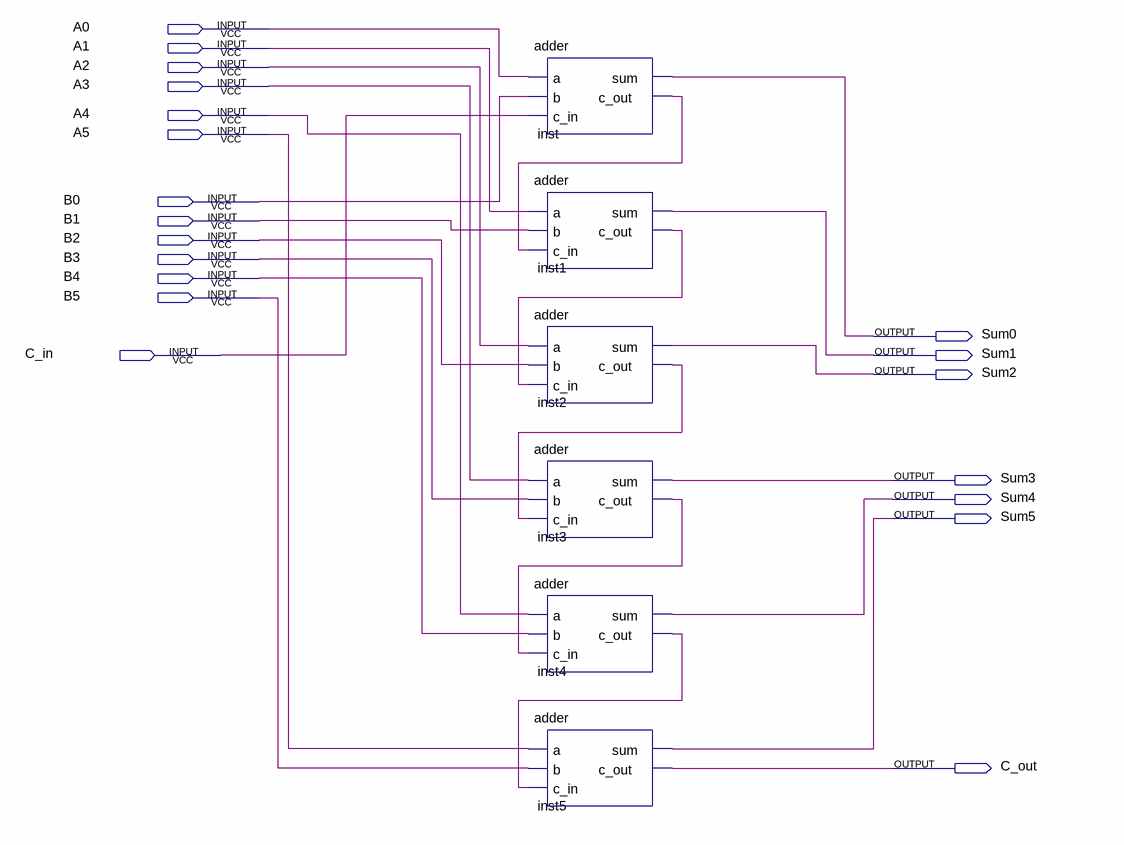
[diagram p0: schematic sheet]
// Quartus schematic Adder6Bit.bdf as structural Verilog: 6 symbols, 20 pins
module Adder6Bit (
  input  A0,
  input  A1,
  input  A2,
  input  A3,
  input  A4,
  input  A5,
  input  B0,
  input  B1,
  input  B2,
  input  B3,
  input  B4,
  input  B5,
  input  C_in,
  output Sum0,
  output Sum1,
  output Sum2,
  output Sum3,
  output Sum4,
  output Sum5,
  output C_out
);

  wire inst1_c_out, inst2_c_out, inst3_c_out, inst4_c_out, inst_c_out;

  adder inst (.a(A0), .b(B0), .c_in(C_in), .sum(Sum0), .c_out(inst_c_out));
  adder inst1 (.a(A1), .b(B1), .c_in(inst_c_out), .sum(Sum1), .c_out(inst1_c_out));
  adder inst2 (.a(A2), .b(B2), .c_in(inst1_c_out), .sum(Sum2), .c_out(inst2_c_out));
  adder inst3 (.a(A3), .b(B3), .c_in(inst2_c_out), .sum(Sum3), .c_out(inst3_c_out));
  adder inst4 (.a(A4), .b(B4), .c_in(inst3_c_out), .sum(Sum4), .c_out(inst4_c_out));
  adder inst5 (.a(A5), .b(B5), .c_in(inst4_c_out), .sum(Sum5), .c_out(C_out));
endmodule
